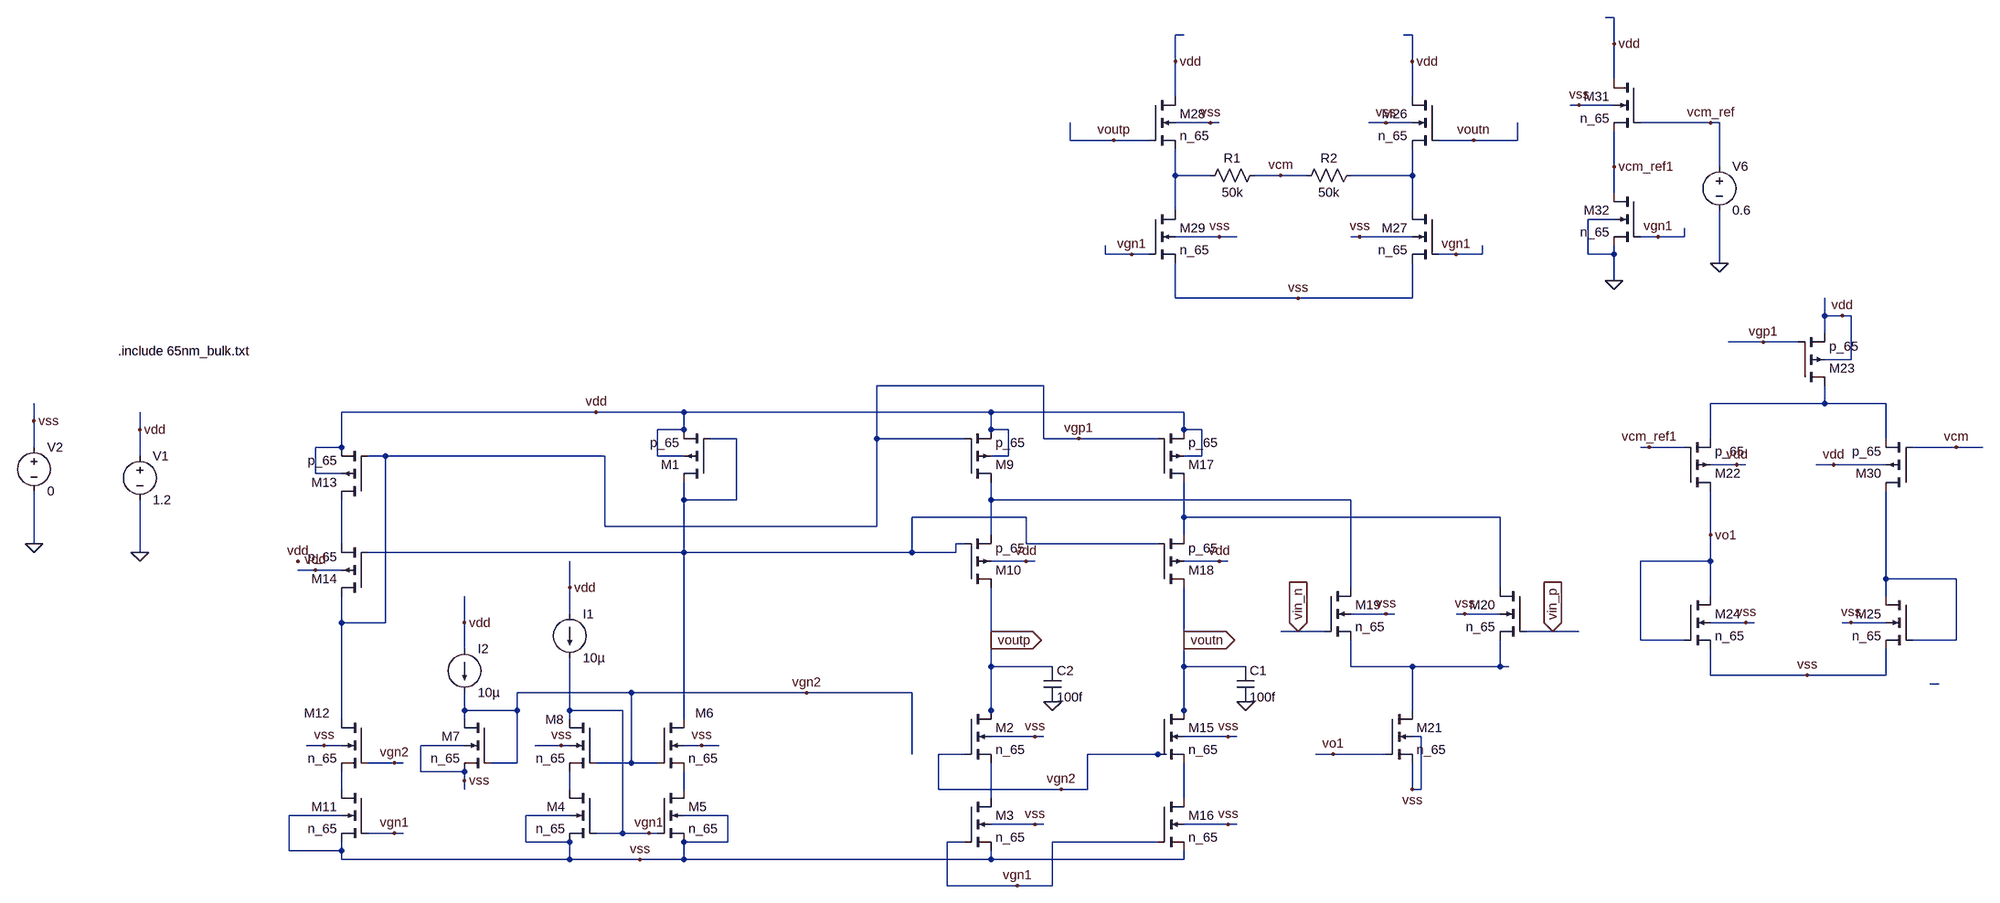
[diagram p0: schematic adc_diff_fast_sym.asc]
adc_diff_fast_sym.asc, the LTspice schematic file:
Version 4
SHEET 1 2596 1296
WIRE 1888 -496 1872 -496
WIRE 1104 -464 1088 -464
WIRE 1520 -464 1504 -464
WIRE 1888 -448 1888 -496
WIRE 1088 -416 1088 -464
WIRE 1520 -416 1520 -464
WIRE 1888 -384 1888 -448
WIRE 1088 -352 1088 -416
WIRE 1520 -352 1520 -416
WIRE 1824 -336 1808 -336
WIRE 1888 -336 1824 -336
WIRE 1152 -304 1088 -304
WIRE 1168 -304 1152 -304
WIRE 1472 -304 1440 -304
WIRE 1520 -304 1472 -304
WIRE 2064 -304 1936 -304
WIRE 2080 -304 2064 -304
WIRE 896 -272 896 -304
WIRE 976 -272 896 -272
WIRE 1040 -272 976 -272
WIRE 1632 -272 1568 -272
WIRE 1712 -272 1712 -304
WIRE 1712 -272 1632 -272
WIRE 1888 -224 1888 -288
WIRE 2080 -224 2080 -304
WIRE 1088 -208 1088 -256
WIRE 1152 -208 1088 -208
WIRE 1280 -208 1232 -208
WIRE 1328 -208 1280 -208
WIRE 1520 -208 1520 -256
WIRE 1520 -208 1408 -208
WIRE 1888 -176 1888 -224
WIRE 1088 -144 1088 -208
WIRE 1520 -144 1520 -208
WIRE 1888 -128 1840 -128
WIRE 1168 -96 1088 -96
WIRE 1200 -96 1168 -96
WIRE 1424 -96 1408 -96
WIRE 1520 -96 1424 -96
WIRE 1968 -96 1936 -96
WIRE 2016 -96 2016 -112
WIRE 2016 -96 1968 -96
WIRE 960 -64 960 -80
WIRE 1008 -64 960 -64
WIRE 1040 -64 1008 -64
WIRE 1600 -64 1568 -64
WIRE 1648 -64 1648 -80
WIRE 1648 -64 1600 -64
WIRE 1840 -64 1840 -128
WIRE 1888 -64 1888 -80
WIRE 1888 -64 1840 -64
WIRE 2080 -48 2080 -144
WIRE 1888 -16 1888 -64
WIRE 1088 16 1088 -48
WIRE 1312 16 1088 16
WIRE 1520 16 1520 -48
WIRE 1520 16 1312 16
WIRE 2272 48 2272 16
WIRE 2304 48 2272 48
WIRE 2320 48 2304 48
WIRE 2272 80 2272 48
WIRE 2160 96 2096 96
WIRE 2224 96 2160 96
WIRE 2320 128 2320 48
WIRE 2320 128 2272 128
WIRE 848 176 544 176
WIRE 2272 208 2272 176
WIRE 2272 208 2064 208
WIRE 2384 208 2272 208
WIRE 32 224 -432 224
WIRE 192 224 32 224
WIRE 752 224 192 224
WIRE 1104 224 752 224
WIRE -1008 240 -1008 208
WIRE -800 256 -800 224
WIRE 192 256 192 224
WIRE 192 256 144 256
WIRE 752 256 752 224
WIRE 784 256 752 256
WIRE 1104 256 1104 224
WIRE 1136 256 1104 256
WIRE 288 272 240 272
WIRE 544 272 544 176
WIRE 704 272 544 272
WIRE 848 272 848 176
WIRE 912 272 848 272
WIRE 1056 272 912 272
WIRE 2064 272 2064 208
WIRE 2384 272 2384 208
WIRE -1008 288 -1008 240
WIRE -432 288 -432 224
WIRE -432 288 -480 288
WIRE 1952 288 1936 288
WIRE 2016 288 1952 288
WIRE 2512 288 2432 288
WIRE 2560 288 2512 288
WIRE -800 304 -800 256
WIRE -432 304 -432 288
WIRE -352 304 -384 304
WIRE 48 304 -352 304
WIRE 144 304 144 256
WIRE 192 304 144 304
WIRE 784 304 784 256
WIRE 784 304 752 304
WIRE 1136 304 1136 256
WIRE 1136 304 1104 304
WIRE 2112 320 2064 320
WIRE 2128 320 2112 320
WIRE 2288 320 2256 320
WIRE 2384 320 2288 320
WIRE -480 336 -480 288
WIRE -432 336 -480 336
WIRE 192 384 192 352
WIRE 288 384 288 272
WIRE 288 384 192 384
WIRE 752 384 752 352
WIRE 1408 384 752 384
WIRE 816 416 608 416
WIRE 1104 416 1104 352
WIRE 1680 416 1104 416
WIRE 48 432 48 304
WIRE 544 432 544 272
WIRE 544 432 48 432
WIRE 752 448 752 384
WIRE 1104 448 1104 416
WIRE 2064 448 2064 368
WIRE -1008 464 -1008 368
WIRE -432 464 -432 384
WIRE 704 464 688 464
WIRE 816 464 816 416
WIRE 1056 464 816 464
WIRE -800 480 -800 384
WIRE 192 480 192 384
WIRE 192 480 -384 480
WIRE 608 480 608 416
WIRE 608 480 192 480
WIRE 688 480 688 464
WIRE 688 480 608 480
WIRE 816 496 752 496
WIRE 832 496 816 496
WIRE 1168 496 1104 496
WIRE 1184 496 1168 496
WIRE 2064 496 2064 448
WIRE 2064 496 1936 496
WIRE -480 512 -512 512
WIRE -432 512 -480 512
WIRE 2384 528 2384 368
WIRE 2512 528 2384 528
WIRE -16 544 -16 496
WIRE 1408 544 1408 384
WIRE 1680 544 1680 416
WIRE 2064 560 2064 496
WIRE 2384 560 2384 528
WIRE -16 592 -16 544
WIRE 1472 592 1408 592
WIRE 1488 592 1472 592
WIRE 1616 592 1600 592
WIRE 1680 592 1616 592
WIRE -432 608 -432 560
WIRE -352 608 -352 304
WIRE -352 608 -432 608
WIRE -208 608 -208 560
WIRE 2128 608 2064 608
WIRE 2144 608 2128 608
WIRE 2320 608 2304 608
WIRE 2384 608 2320 608
WIRE 1312 624 1280 624
WIRE 1360 624 1312 624
WIRE 1776 624 1728 624
WIRE 1824 624 1776 624
WIRE 752 640 752 544
WIRE 1104 640 1104 544
WIRE 1936 640 1936 496
WIRE 2016 640 1936 640
WIRE 2512 640 2512 528
WIRE 2512 640 2432 640
WIRE -208 656 -208 608
WIRE 752 688 752 640
WIRE 864 688 752 688
WIRE 1104 688 1104 640
WIRE 1216 688 1104 688
WIRE 1408 688 1408 640
WIRE 1520 688 1408 688
WIRE 1680 688 1680 640
WIRE 1680 688 1520 688
WIRE 1696 688 1680 688
WIRE 2064 704 2064 656
WIRE 2240 704 2064 704
WIRE 2384 704 2384 656
WIRE 2384 704 2240 704
WIRE 2480 720 2464 720
WIRE 96 736 -112 736
WIRE 416 736 96 736
WIRE 608 736 416 736
WIRE -208 768 -208 736
WIRE -112 768 -112 736
WIRE -112 768 -208 768
WIRE -16 768 -16 672
WIRE 80 768 -16 768
WIRE 752 768 752 688
WIRE 1104 768 1104 688
WIRE 1520 768 1520 688
WIRE -432 784 -432 608
WIRE -208 784 -208 768
WIRE -16 784 -16 768
WIRE 192 784 192 480
WIRE 752 784 752 768
WIRE 1104 784 1104 768
WIRE 832 816 752 816
WIRE 848 816 832 816
WIRE 1184 816 1104 816
WIRE 1200 816 1184 816
WIRE 1536 816 1520 816
WIRE -464 832 -496 832
WIRE -432 832 -464 832
WIRE -208 832 -288 832
WIRE -32 832 -80 832
WIRE -16 832 -32 832
WIRE 224 832 192 832
WIRE 256 832 224 832
WIRE 608 848 608 736
WIRE 704 848 656 848
WIRE 1056 848 928 848
WIRE 1072 848 1056 848
WIRE 1376 848 1344 848
WIRE 1472 848 1376 848
WIRE -336 864 -384 864
WIRE -320 864 -336 864
WIRE -112 864 -112 768
WIRE -112 864 -160 864
WIRE 96 864 96 736
WIRE 96 864 32 864
WIRE 144 864 96 864
WIRE -288 880 -288 832
WIRE -208 880 -288 880
WIRE -208 896 -208 880
WIRE -432 912 -432 880
WIRE -208 912 -208 896
WIRE -16 912 -16 880
WIRE 192 912 192 880
WIRE 656 912 656 848
WIRE 880 912 656 912
WIRE 928 912 928 848
WIRE 928 912 880 912
WIRE 1520 912 1520 864
WIRE 1536 912 1536 816
WIRE 1536 912 1520 912
WIRE 752 928 752 864
WIRE 1104 928 1104 864
WIRE -432 960 -528 960
WIRE -16 960 -96 960
WIRE 272 960 192 960
WIRE 832 976 752 976
WIRE 848 976 832 976
WIRE 1184 976 1104 976
WIRE 1200 976 1184 976
WIRE -336 992 -384 992
WIRE -320 992 -336 992
WIRE 80 992 80 768
WIRE 80 992 32 992
WIRE 128 992 80 992
WIRE 144 992 128 992
WIRE -96 1008 -96 960
WIRE -16 1008 -96 1008
WIRE 272 1008 272 960
WIRE 272 1008 192 1008
WIRE 704 1008 672 1008
WIRE 1056 1008 864 1008
WIRE -528 1024 -528 960
WIRE -432 1024 -432 1008
WIRE -432 1024 -528 1024
WIRE -432 1040 -432 1024
WIRE -16 1040 -16 1008
WIRE -16 1040 -432 1040
WIRE 112 1040 -16 1040
WIRE 192 1040 192 1008
WIRE 192 1040 112 1040
WIRE 752 1040 752 1024
WIRE 752 1040 192 1040
WIRE 1104 1040 1104 1024
WIRE 1104 1040 752 1040
WIRE 672 1088 672 1008
WIRE 800 1088 672 1088
WIRE 864 1088 864 1008
WIRE 864 1088 800 1088
FLAG -16 544 vdd
FLAG 832 816 vss
FLAG 832 976 vss
FLAG 224 832 vss
FLAG 112 1040 vss
FLAG -208 608 vdd
FLAG -208 896 vss
FLAG -32 832 vss
FLAG 816 496 vdd
FLAG -464 832 vss
FLAG -336 992 vgn1
FLAG -336 864 vgn2
FLAG 32 224 vdd
FLAG -800 480 0
FLAG -800 256 vdd
FLAG -1008 464 0
FLAG -1008 240 vss
FLAG 752 640 voutp
IOPIN 752 640 Out
FLAG 1184 816 vss
FLAG 1184 976 vss
FLAG 1168 496 vdd
FLAG 1104 640 voutn
IOPIN 1104 640 Out
FLAG 1472 592 vss
FLAG 1616 592 vss
FLAG 1520 912 vss
FLAG 2240 704 vss
FLAG 2128 608 vss
FLAG 2320 608 vss
FLAG 2304 48 vdd
FLAG 2112 320 vdd
FLAG 1776 624 vin_p
IOPIN 1776 624 In
FLAG 1312 624 vin_n
IOPIN 1312 624 In
FLAG 912 272 vgp1
FLAG 864 752 0
FLAG 1216 752 0
FLAG 416 736 vgn2
FLAG 800 1088 vgn1
FLAG 880 912 vgn2
FLAG 1520 -416 vdd
FLAG 1600 -64 vgn1
FLAG 1632 -272 voutn
FLAG 1088 -416 vdd
FLAG 1008 -64 vgn1
FLAG 976 -272 voutp
FLAG 1312 16 vss
FLAG 1280 -208 vcm
FLAG 2288 320 vdd
FLAG 2512 288 vcm
FLAG 2160 96 vgp1
FLAG 128 992 vgn1
FLAG 1888 -448 vdd
FLAG 1968 -96 vgn1
FLAG 2080 -48 0
FLAG 2064 -304 vcm_ref
FLAG 1888 -224 vcm_ref1
FLAG 1952 288 vcm_ref1
FLAG 1888 -16 0
FLAG 2064 448 vo1
FLAG 1376 848 vo1
FLAG -512 496 vdd
FLAG -480 512 vdd
FLAG 1152 -304 vss
FLAG 1472 -304 vss
FLAG 1168 -96 vss
FLAG 1424 -96 vss
FLAG 1824 -336 vss
DATAFLAG 528 736 ""
DATAFLAG 608 480 ""
DATAFLAG 864 256 ""
DATAFLAG 1104 240 ""
DATAFLAG 2112 208 ""
DATAFLAG 2064 416 ""
DATAFLAG 2384 480 ""
DATAFLAG 752 592 ""
DATAFLAG 1104 592 ""
DATAFLAG 2256 640 ""
DATAFLAG 1520 416 ""
DATAFLAG 832 384 ""
DATAFLAG 1104 912 ""
DATAFLAG 752 912 ""
DATAFLAG 1520 896 ""
DATAFLAG 720 1008 ""
DATAFLAG 960 464 ""
DATAFLAG 944 992 ""
DATAFLAG 1088 -240 ""
DATAFLAG 1520 -224 ""
DATAFLAG 912 -272 ""
DATAFLAG 1712 -288 ""
DATAFLAG -368 864 ""
DATAFLAG 48 864 ""
DATAFLAG -64 304 ""
DATAFLAG -112 480 ""
DATAFLAG -432 400 ""
DATAFLAG 2000 -320 ""
DATAFLAG 2048 528 ""
DATAFLAG 1408 432 ""
DATAFLAG 1520 736 ""
DATAFLAG 1392 832 ""
DATAFLAG 1888 -272 "$"
SYMBOL pmos4 240 352 R180
SYMATTR InstName M1
SYMATTR Value p_65
SYMATTR Value2 l=500n w=5u
SYMBOL nmos4 704 768 R0
SYMATTR InstName M2
SYMATTR Value n_65
SYMATTR Value2 l=500n w=20u
SYMBOL nmos4 704 928 R0
SYMATTR InstName M3
SYMATTR Value n_65
SYMATTR Value2 l=500n w=20u
SYMBOL nmos4 32 912 M0
SYMATTR InstName M4
SYMATTR Value n_65
SYMATTR Value2 l=500n w=20u
SYMBOL current -16 592 R0
WINDOW 123 0 0 Left 0
WINDOW 39 0 0 Left 0
SYMATTR InstName I1
SYMATTR Value 10µ
SYMBOL nmos4 144 912 R0
SYMATTR InstName M5
SYMATTR Value n_65
SYMATTR Value2 l=500n w=20u
SYMBOL nmos4 144 784 R0
WINDOW 0 69 -11 Left 2
SYMATTR InstName M6
SYMATTR Value n_65
SYMATTR Value2 l=500n w=20u
SYMBOL nmos4 -160 784 M0
SYMATTR InstName M7
SYMATTR Value n_65
SYMATTR Value2 l=500n w=5u
SYMBOL current -208 656 R0
WINDOW 123 0 0 Left 0
WINDOW 39 0 0 Left 0
SYMATTR InstName I2
SYMATTR Value 10µ
SYMBOL nmos4 32 784 M0
WINDOW 0 59 1 Left 2
SYMATTR InstName M8
SYMATTR Value n_65
SYMATTR Value2 l=500n w=20u
SYMBOL pmos4 704 352 M180
SYMATTR InstName M9
SYMATTR Value p_65
SYMATTR Value2 l=500n w=40u
SYMBOL pmos4 704 544 M180
SYMATTR InstName M10
SYMATTR Value p_65
SYMATTR Value2 l=500n w=20u
SYMBOL nmos4 -384 912 M0
SYMATTR InstName M11
SYMATTR Value n_65
SYMATTR Value2 l=500n w=20u
SYMBOL nmos4 -384 784 M0
WINDOW 0 69 -11 Left 2
SYMATTR InstName M12
SYMATTR Value n_65
SYMATTR Value2 l=500n w=20u
SYMBOL pmos4 -384 384 R180
SYMATTR InstName M13
SYMATTR Value p_65
SYMATTR Value2 l=500n w=20u
SYMBOL pmos4 -384 560 R180
SYMATTR InstName M14
SYMATTR Value p_65
SYMATTR Value2 l=500n w=20u
SYMBOL voltage -800 288 R0
WINDOW 123 0 0 Left 0
WINDOW 39 0 0 Left 0
SYMATTR InstName V1
SYMATTR Value 1.2
SYMBOL voltage -1008 272 R0
WINDOW 123 0 0 Left 0
WINDOW 39 0 0 Left 0
SYMATTR InstName V2
SYMATTR Value 0
SYMBOL nmos4 1056 768 R0
SYMATTR InstName M15
SYMATTR Value n_65
SYMATTR Value2 l=500n w=20u
SYMBOL nmos4 1056 928 R0
SYMATTR InstName M16
SYMATTR Value n_65
SYMATTR Value2 l=500n w=20u
SYMBOL pmos4 1056 352 M180
SYMATTR InstName M17
SYMATTR Value p_65
SYMATTR Value2 l=500n w=40u
SYMBOL pmos4 1056 544 M180
SYMATTR InstName M18
SYMATTR Value p_65
SYMATTR Value2 l=500n w=20u
SYMBOL nmos4 1360 544 R0
SYMATTR InstName M19
SYMATTR Value n_65
SYMATTR Value2 l=500n w=80u
SYMBOL nmos4 1728 544 M0
SYMATTR InstName M20
SYMATTR Value n_65
SYMATTR Value2 l=500n w=80u
SYMBOL nmos4 1472 768 R0
SYMATTR InstName M21
SYMATTR Value n_65
SYMATTR Value2 l=500n w=40u
SYMBOL pmos4 2016 368 M180
SYMATTR InstName M22
SYMATTR Value p_65
SYMATTR Value2 l=65n w=90u
SYMBOL pmos4 2224 176 M180
SYMATTR InstName M23
SYMATTR Value p_65
SYMATTR Value2 l=200n w=20u
SYMBOL nmos4 2016 560 R0
SYMATTR InstName M24
SYMATTR Value n_65
SYMATTR Value2 l=500n w=20u
SYMBOL nmos4 2432 560 M0
SYMATTR InstName M25
SYMATTR Value n_65
SYMATTR Value2 l=500n w=20u
SYMBOL cap 1200 688 R0
SYMATTR InstName C1
SYMATTR Value 100f
SYMBOL cap 848 688 R0
SYMATTR InstName C2
SYMATTR Value 100f
SYMBOL nmos4 1568 -352 M0
SYMATTR InstName M26
SYMATTR Value n_65
SYMATTR Value2 l=65n w=20u
SYMBOL nmos4 1568 -144 M0
SYMATTR InstName M27
SYMATTR Value n_65
SYMATTR Value2 l=200n w=20u
SYMBOL nmos4 1040 -352 R0
SYMATTR InstName M28
SYMATTR Value n_65
SYMATTR Value2 l=65n w=20u
SYMBOL nmos4 1040 -144 R0
SYMATTR InstName M29
SYMATTR Value n_65
SYMATTR Value2 l=200n w=20u
SYMBOL res 1248 -224 R90
WINDOW 0 0 56 VBottom 2
WINDOW 3 32 56 VTop 2
SYMATTR InstName R1
SYMATTR Value 50k
SYMATTR SpiceLine tol=1 pwr=0.1
SYMBOL res 1424 -224 R90
WINDOW 0 0 56 VBottom 2
WINDOW 3 32 56 VTop 2
SYMATTR InstName R2
SYMATTR Value 50k
SYMATTR SpiceLine tol=1 pwr=0.1
SYMBOL pmos4 2432 368 R180
SYMATTR InstName M30
SYMATTR Value p_65
SYMATTR Value2 l=65n w=90u
SYMBOL nmos4 1936 -384 M0
SYMATTR InstName M31
SYMATTR Value n_65
SYMATTR Value2 l=65n w=20u
SYMBOL nmos4 1936 -176 M0
SYMATTR InstName M32
SYMATTR Value n_65
SYMATTR Value2 l=200n w=20u
SYMBOL voltage 2080 -240 R0
WINDOW 123 0 0 Left 0
WINDOW 39 0 0 Left 0
SYMATTR InstName V6
SYMATTR Value 0.6
TEXT -840 112 Left 2 !.include 65nm_bulk.txt

The netlist it stands for:
* adc_diff_fast_sym.asc
M1 N004 N004 vdd vdd p_65 l=500n w=5u
M2 voutp vgn2 N014 vss n_65 l=500n w=20u
M3 N014 vgn1 vss vss n_65 l=500n w=20u
M4 N012 vgn1 vss vss n_65 l=500n w=20u
I1 vdd vgn1 10µ
M5 N013 vgn1 vss vss n_65 l=500n w=20u
M6 N004 vgn2 N013 vss n_65 l=500n w=20u
M7 vgn2 vgn2 vss vss n_65 l=500n w=5u
I2 vdd vgn2 10µ
M8 vgn1 vgn2 N012 vss n_65 l=500n w=20u
M9 N005 vgp1 vdd vdd p_65 l=500n w=40u
M10 voutp N004 N005 vdd p_65 l=500n w=20u
M11 N011 vgn1 vss vss n_65 l=500n w=20u
M12 vgp1 vgn2 N011 vss n_65 l=500n w=20u
M13 N007 vgp1 vdd vdd p_65 l=500n w=20u
M14 vgp1 N004 N007 vdd p_65 l=500n w=20u
V1 vdd 0 1.2
V2 vss 0 0
M15 voutn vgn2 N015 vss n_65 l=500n w=20u
M16 N015 vgn1 vss vss n_65 l=500n w=20u
M17 N006 vgp1 vdd vdd p_65 l=500n w=40u
M18 voutn N004 N006 vdd p_65 l=500n w=20u
M19 N005 vin_n N009 vss n_65 l=500n w=80u
M20 N006 vin_p N009 vss n_65 l=500n w=80u
M21 N009 vo1 vss vss n_65 l=500n w=40u
M22 vo1 vcm_ref1 N003 vdd p_65 l=65n w=90u
M23 N003 vgp1 vdd vdd p_65 l=200n w=20u
M24 vo1 vo1 vss vss n_65 l=500n w=20u
M25 N008 N008 vss vss n_65 l=500n w=20u
C1 voutn 0 100f
C2 voutp 0 100f
M26 vdd voutn N002 vss n_65 l=65n w=20u
M27 N002 vgn1 vss vss n_65 l=200n w=20u
M28 vdd voutp N001 vss n_65 l=65n w=20u
M29 N001 vgn1 vss vss n_65 l=200n w=20u
R1 vcm N001 50k tol=1 pwr=0.1
R2 N002 vcm 50k tol=1 pwr=0.1
M30 N008 vcm N003 vdd p_65 l=65n w=90u
M31 vdd vcm_ref vcm_ref1 vss n_65 l=65n w=20u
M32 vcm_ref1 vgn1 0 0 n_65 l=200n w=20u
V6 vcm_ref 0 0.6
.model NMOS NMOS
.model PMOS PMOS
.lib standard.mos
.include 65nm_bulk.txt
.backanno
.end